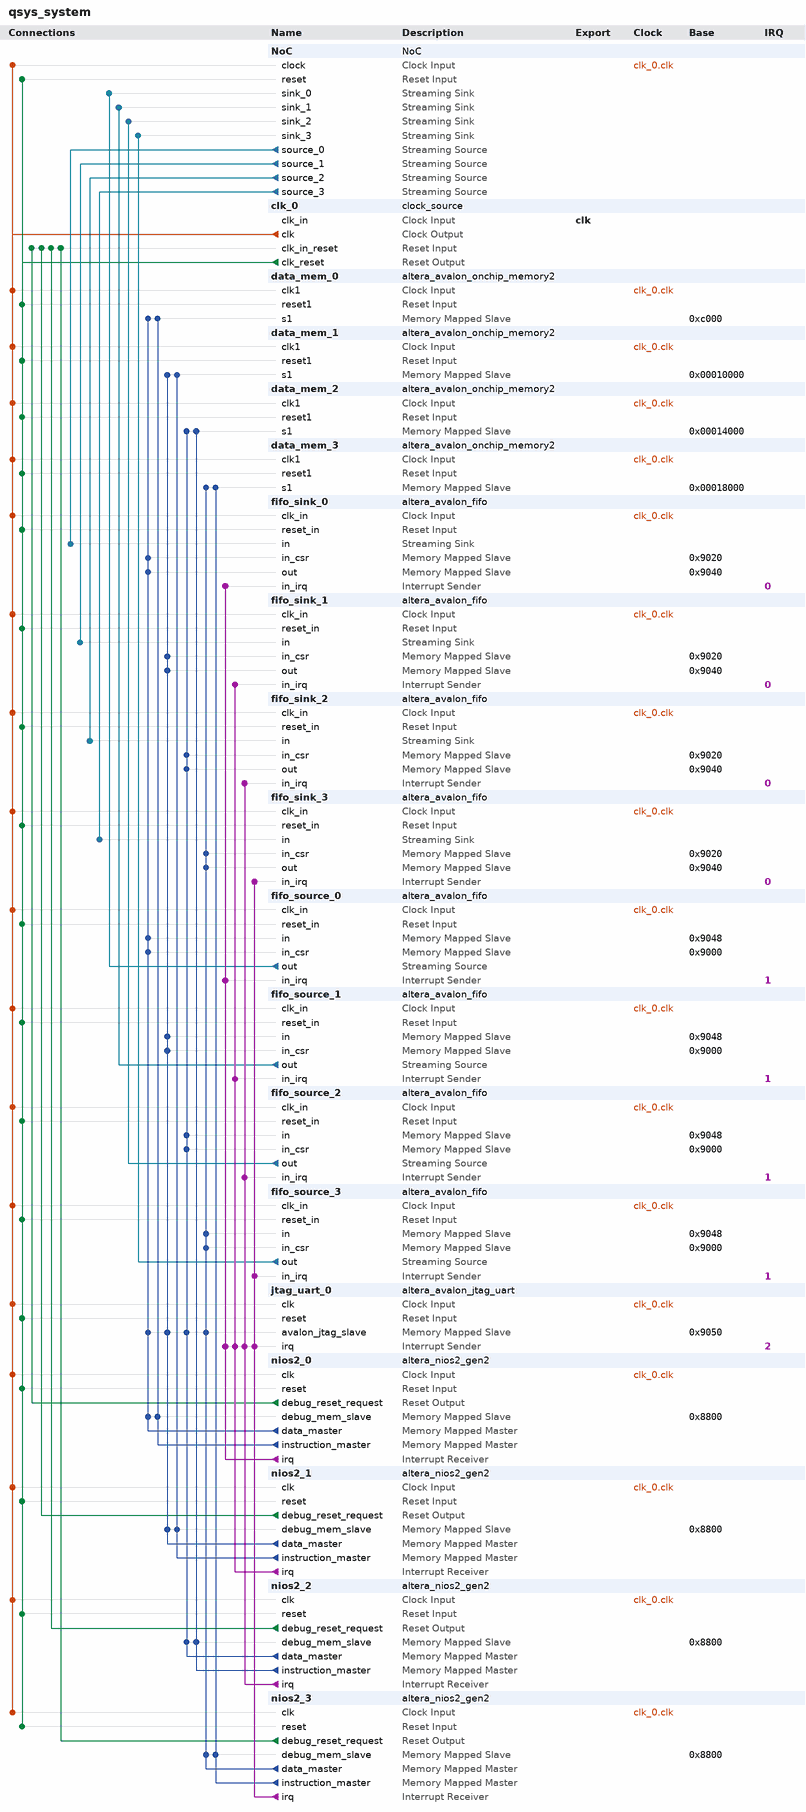
[diagram p0: system contents]
# Platform Designer (Qsys) system qsys_system, Cyclone V 5CSEMA4U23C6
# Parameters at their usual value, and those the tool derives, are not listed.
package require -exact qsys 17.1
create_system qsys_system
set_project_property DEVICE_FAMILY {Cyclone V}
set_project_property DEVICE 5CSEMA4U23C6

add_instance NoC NoC 1.0
set_instance_parameter_value NoC ColNo 2
set_instance_parameter_value NoC DataWidth 8
set_instance_parameter_value NoC PackWidth 8
set_instance_parameter_value NoC PhyCh 4
set_instance_parameter_value NoC PhyChAddr 2
set_instance_parameter_value NoC PhyRoCh 5
set_instance_parameter_value NoC PhyRoChAddr 3
set_instance_parameter_value NoC RoCh 1
set_instance_parameter_value NoC RoChAddr 1
set_instance_parameter_value NoC RowNo 2
set_instance_parameter_value NoC ViCh 1
set_instance_parameter_value NoC ViChAddr 1

add_instance clk_0 clock_source 17.1
set_instance_parameter_value clk_0 clockFrequency 50000000

add_instance data_mem_0 altera_avalon_onchip_memory2 17.1
set_instance_parameter_value data_mem_0 dataWidth 32
set_instance_parameter_value data_mem_0 dualPort false
set_instance_parameter_value data_mem_0 initMemContent true
set_instance_parameter_value data_mem_0 initializationFileName onchip_mem.hex
set_instance_parameter_value data_mem_0 memorySize 16384

add_instance data_mem_1 altera_avalon_onchip_memory2 17.1
set_instance_parameter_value data_mem_1 dataWidth 32
set_instance_parameter_value data_mem_1 dualPort false
set_instance_parameter_value data_mem_1 initMemContent true
set_instance_parameter_value data_mem_1 initializationFileName onchip_mem.hex
set_instance_parameter_value data_mem_1 memorySize 16384

add_instance data_mem_2 altera_avalon_onchip_memory2 17.1
set_instance_parameter_value data_mem_2 dataWidth 32
set_instance_parameter_value data_mem_2 dualPort false
set_instance_parameter_value data_mem_2 initMemContent true
set_instance_parameter_value data_mem_2 initializationFileName onchip_mem.hex
set_instance_parameter_value data_mem_2 memorySize 16384

add_instance data_mem_3 altera_avalon_onchip_memory2 17.1
set_instance_parameter_value data_mem_3 dataWidth 32
set_instance_parameter_value data_mem_3 dualPort false
set_instance_parameter_value data_mem_3 initMemContent true
set_instance_parameter_value data_mem_3 initializationFileName onchip_mem.hex
set_instance_parameter_value data_mem_3 memorySize 32000

add_instance fifo_sink_0 altera_avalon_fifo 17.1
set_instance_parameter_value fifo_sink_0 bitsPerSymbol 8
set_instance_parameter_value fifo_sink_0 channelWidth 8
set_instance_parameter_value fifo_sink_0 errorWidth 8
set_instance_parameter_value fifo_sink_0 fifoDepth 16
set_instance_parameter_value fifo_sink_0 fifoInputInterfaceOptions AVALONST_SINK
set_instance_parameter_value fifo_sink_0 fifoOutputInterfaceOptions AVALONMM_READ
set_instance_parameter_value fifo_sink_0 singleClockMode true
set_instance_parameter_value fifo_sink_0 symbolsPerBeat 4
set_instance_parameter_value fifo_sink_0 useIRQ true
set_instance_parameter_value fifo_sink_0 usePacket false
set_instance_parameter_value fifo_sink_0 useReadControl false

add_instance fifo_sink_1 altera_avalon_fifo 17.1
set_instance_parameter_value fifo_sink_1 bitsPerSymbol 8
set_instance_parameter_value fifo_sink_1 channelWidth 8
set_instance_parameter_value fifo_sink_1 errorWidth 8
set_instance_parameter_value fifo_sink_1 fifoDepth 16
set_instance_parameter_value fifo_sink_1 fifoInputInterfaceOptions AVALONST_SINK
set_instance_parameter_value fifo_sink_1 fifoOutputInterfaceOptions AVALONMM_READ
set_instance_parameter_value fifo_sink_1 singleClockMode true
set_instance_parameter_value fifo_sink_1 symbolsPerBeat 4
set_instance_parameter_value fifo_sink_1 useIRQ true
set_instance_parameter_value fifo_sink_1 usePacket false
set_instance_parameter_value fifo_sink_1 useReadControl false

add_instance fifo_sink_2 altera_avalon_fifo 17.1
set_instance_parameter_value fifo_sink_2 bitsPerSymbol 8
set_instance_parameter_value fifo_sink_2 channelWidth 8
set_instance_parameter_value fifo_sink_2 errorWidth 8
set_instance_parameter_value fifo_sink_2 fifoDepth 16
set_instance_parameter_value fifo_sink_2 fifoInputInterfaceOptions AVALONST_SINK
set_instance_parameter_value fifo_sink_2 fifoOutputInterfaceOptions AVALONMM_READ
set_instance_parameter_value fifo_sink_2 singleClockMode true
set_instance_parameter_value fifo_sink_2 symbolsPerBeat 4
set_instance_parameter_value fifo_sink_2 useIRQ true
set_instance_parameter_value fifo_sink_2 usePacket false
set_instance_parameter_value fifo_sink_2 useReadControl false

add_instance fifo_sink_3 altera_avalon_fifo 17.1
set_instance_parameter_value fifo_sink_3 bitsPerSymbol 8
set_instance_parameter_value fifo_sink_3 channelWidth 8
set_instance_parameter_value fifo_sink_3 errorWidth 8
set_instance_parameter_value fifo_sink_3 fifoDepth 16
set_instance_parameter_value fifo_sink_3 fifoInputInterfaceOptions AVALONST_SINK
set_instance_parameter_value fifo_sink_3 fifoOutputInterfaceOptions AVALONMM_READ
set_instance_parameter_value fifo_sink_3 singleClockMode true
set_instance_parameter_value fifo_sink_3 symbolsPerBeat 4
set_instance_parameter_value fifo_sink_3 useIRQ true
set_instance_parameter_value fifo_sink_3 usePacket false
set_instance_parameter_value fifo_sink_3 useReadControl false

add_instance fifo_source_0 altera_avalon_fifo 17.1
set_instance_parameter_value fifo_source_0 bitsPerSymbol 8
set_instance_parameter_value fifo_source_0 channelWidth 8
set_instance_parameter_value fifo_source_0 errorWidth 8
set_instance_parameter_value fifo_source_0 fifoDepth 16
set_instance_parameter_value fifo_source_0 fifoInputInterfaceOptions AVALONMM_WRITE
set_instance_parameter_value fifo_source_0 fifoOutputInterfaceOptions AVALONST_SOURCE
set_instance_parameter_value fifo_source_0 singleClockMode true
set_instance_parameter_value fifo_source_0 symbolsPerBeat 4
set_instance_parameter_value fifo_source_0 useIRQ true
set_instance_parameter_value fifo_source_0 usePacket false
set_instance_parameter_value fifo_source_0 useReadControl false

add_instance fifo_source_1 altera_avalon_fifo 17.1
set_instance_parameter_value fifo_source_1 bitsPerSymbol 8
set_instance_parameter_value fifo_source_1 channelWidth 8
set_instance_parameter_value fifo_source_1 errorWidth 8
set_instance_parameter_value fifo_source_1 fifoDepth 16
set_instance_parameter_value fifo_source_1 fifoInputInterfaceOptions AVALONMM_WRITE
set_instance_parameter_value fifo_source_1 fifoOutputInterfaceOptions AVALONST_SOURCE
set_instance_parameter_value fifo_source_1 singleClockMode true
set_instance_parameter_value fifo_source_1 symbolsPerBeat 4
set_instance_parameter_value fifo_source_1 useIRQ true
set_instance_parameter_value fifo_source_1 usePacket false
set_instance_parameter_value fifo_source_1 useReadControl false

add_instance fifo_source_2 altera_avalon_fifo 17.1
set_instance_parameter_value fifo_source_2 bitsPerSymbol 8
set_instance_parameter_value fifo_source_2 channelWidth 8
set_instance_parameter_value fifo_source_2 errorWidth 8
set_instance_parameter_value fifo_source_2 fifoDepth 16
set_instance_parameter_value fifo_source_2 fifoInputInterfaceOptions AVALONMM_WRITE
set_instance_parameter_value fifo_source_2 fifoOutputInterfaceOptions AVALONST_SOURCE
set_instance_parameter_value fifo_source_2 singleClockMode true
set_instance_parameter_value fifo_source_2 symbolsPerBeat 4
set_instance_parameter_value fifo_source_2 useIRQ true
set_instance_parameter_value fifo_source_2 usePacket false
set_instance_parameter_value fifo_source_2 useReadControl false

add_instance fifo_source_3 altera_avalon_fifo 17.1
set_instance_parameter_value fifo_source_3 bitsPerSymbol 8
set_instance_parameter_value fifo_source_3 channelWidth 8
set_instance_parameter_value fifo_source_3 errorWidth 8
set_instance_parameter_value fifo_source_3 fifoDepth 16
set_instance_parameter_value fifo_source_3 fifoInputInterfaceOptions AVALONMM_WRITE
set_instance_parameter_value fifo_source_3 fifoOutputInterfaceOptions AVALONST_SOURCE
set_instance_parameter_value fifo_source_3 singleClockMode true
set_instance_parameter_value fifo_source_3 symbolsPerBeat 4
set_instance_parameter_value fifo_source_3 useIRQ true
set_instance_parameter_value fifo_source_3 usePacket false
set_instance_parameter_value fifo_source_3 useReadControl false

add_instance jtag_uart_0 altera_avalon_jtag_uart 17.1
set_instance_parameter_value jtag_uart_0 simInteractiveOptions NO_INTERACTIVE_WINDOWS

add_instance nios2_0 altera_nios2_gen2 17.1
set_instance_parameter_value nios2_0 dcache_size 2048
set_instance_parameter_value nios2_0 exceptionSlave data_mem_0.s1
set_instance_parameter_value nios2_0 icache_size 4096
set_instance_parameter_value nios2_0 impl Tiny
set_instance_parameter_value nios2_0 resetSlave data_mem_0.s1

add_instance nios2_1 altera_nios2_gen2 17.1
set_instance_parameter_value nios2_1 dcache_size 2048
set_instance_parameter_value nios2_1 exceptionSlave data_mem_1.s1
set_instance_parameter_value nios2_1 icache_size 4096
set_instance_parameter_value nios2_1 impl Tiny
set_instance_parameter_value nios2_1 resetSlave data_mem_1.s1

add_instance nios2_2 altera_nios2_gen2 17.1
set_instance_parameter_value nios2_2 dcache_size 2048
set_instance_parameter_value nios2_2 exceptionSlave data_mem_2.s1
set_instance_parameter_value nios2_2 icache_size 4096
set_instance_parameter_value nios2_2 impl Tiny
set_instance_parameter_value nios2_2 resetSlave data_mem_2.s1

add_instance nios2_3 altera_nios2_gen2 17.1
set_instance_parameter_value nios2_3 dcache_size 2048
set_instance_parameter_value nios2_3 exceptionSlave data_mem_3.s1
set_instance_parameter_value nios2_3 icache_size 4096
set_instance_parameter_value nios2_3 impl Tiny
set_instance_parameter_value nios2_3 resetSlave data_mem_3.s1

# connections
add_connection clk_0.clk data_mem_0.clk1 clock
add_connection clk_0.clk data_mem_1.clk1 clock
add_connection clk_0.clk data_mem_2.clk1 clock
add_connection clk_0.clk data_mem_3.clk1 clock
add_connection clk_0.clk fifo_sink_0.clk_in clock
add_connection clk_0.clk fifo_sink_1.clk_in clock
add_connection clk_0.clk fifo_sink_2.clk_in clock
add_connection clk_0.clk fifo_sink_3.clk_in clock
add_connection clk_0.clk fifo_source_0.clk_in clock
add_connection clk_0.clk fifo_source_1.clk_in clock
add_connection clk_0.clk fifo_source_2.clk_in clock
add_connection clk_0.clk fifo_source_3.clk_in clock
add_connection clk_0.clk jtag_uart_0.clk clock
add_connection clk_0.clk nios2_0.clk clock
add_connection clk_0.clk nios2_1.clk clock
add_connection clk_0.clk nios2_2.clk clock
add_connection clk_0.clk nios2_3.clk clock
add_connection clk_0.clk NoC.clock clock
add_connection clk_0.clk_reset data_mem_0.reset1 reset
add_connection clk_0.clk_reset data_mem_1.reset1 reset
add_connection clk_0.clk_reset data_mem_2.reset1 reset
add_connection clk_0.clk_reset data_mem_3.reset1 reset
add_connection clk_0.clk_reset fifo_sink_0.reset_in reset
add_connection clk_0.clk_reset fifo_sink_1.reset_in reset
add_connection clk_0.clk_reset fifo_sink_2.reset_in reset
add_connection clk_0.clk_reset fifo_sink_3.reset_in reset
add_connection clk_0.clk_reset fifo_source_0.reset_in reset
add_connection clk_0.clk_reset fifo_source_1.reset_in reset
add_connection clk_0.clk_reset fifo_source_2.reset_in reset
add_connection clk_0.clk_reset fifo_source_3.reset_in reset
add_connection clk_0.clk_reset jtag_uart_0.reset reset
add_connection clk_0.clk_reset nios2_0.reset reset
add_connection clk_0.clk_reset nios2_1.reset reset
add_connection clk_0.clk_reset nios2_2.reset reset
add_connection clk_0.clk_reset nios2_3.reset reset
add_connection clk_0.clk_reset NoC.reset reset
add_connection nios2_0.debug_reset_request clk_0.clk_in_reset reset
add_connection nios2_1.debug_reset_request clk_0.clk_in_reset reset
add_connection nios2_2.debug_reset_request clk_0.clk_in_reset reset
add_connection nios2_3.debug_reset_request clk_0.clk_in_reset reset
add_connection nios2_0.data_master data_mem_0.s1 avalon
set_connection_parameter_value nios2_0.data_master/data_mem_0.s1 baseAddress 0xc000
add_connection nios2_0.data_master fifo_sink_0.in_csr avalon
set_connection_parameter_value nios2_0.data_master/fifo_sink_0.in_csr baseAddress 0x9020
add_connection nios2_0.data_master fifo_sink_0.out avalon
set_connection_parameter_value nios2_0.data_master/fifo_sink_0.out baseAddress 0x9040
add_connection nios2_0.data_master fifo_source_0.in avalon
set_connection_parameter_value nios2_0.data_master/fifo_source_0.in baseAddress 0x9048
add_connection nios2_0.data_master fifo_source_0.in_csr avalon
set_connection_parameter_value nios2_0.data_master/fifo_source_0.in_csr baseAddress 0x9000
add_connection nios2_0.data_master jtag_uart_0.avalon_jtag_slave avalon
set_connection_parameter_value nios2_0.data_master/jtag_uart_0.avalon_jtag_slave baseAddress 0x9050
add_connection nios2_0.data_master nios2_0.debug_mem_slave avalon
set_connection_parameter_value nios2_0.data_master/nios2_0.debug_mem_slave baseAddress 0x8800
add_connection nios2_0.instruction_master data_mem_0.s1 avalon
set_connection_parameter_value nios2_0.instruction_master/data_mem_0.s1 baseAddress 0xc000
add_connection nios2_0.instruction_master nios2_0.debug_mem_slave avalon
set_connection_parameter_value nios2_0.instruction_master/nios2_0.debug_mem_slave baseAddress 0x8800
add_connection nios2_1.data_master data_mem_1.s1 avalon
set_connection_parameter_value nios2_1.data_master/data_mem_1.s1 baseAddress 0x00010000
add_connection nios2_1.data_master fifo_sink_1.in_csr avalon
set_connection_parameter_value nios2_1.data_master/fifo_sink_1.in_csr baseAddress 0x9020
add_connection nios2_1.data_master fifo_sink_1.out avalon
set_connection_parameter_value nios2_1.data_master/fifo_sink_1.out baseAddress 0x9040
add_connection nios2_1.data_master fifo_source_1.in avalon
set_connection_parameter_value nios2_1.data_master/fifo_source_1.in baseAddress 0x9048
add_connection nios2_1.data_master fifo_source_1.in_csr avalon
set_connection_parameter_value nios2_1.data_master/fifo_source_1.in_csr baseAddress 0x9000
add_connection nios2_1.data_master jtag_uart_0.avalon_jtag_slave avalon
set_connection_parameter_value nios2_1.data_master/jtag_uart_0.avalon_jtag_slave baseAddress 0x9050
add_connection nios2_1.data_master nios2_1.debug_mem_slave avalon
set_connection_parameter_value nios2_1.data_master/nios2_1.debug_mem_slave baseAddress 0x8800
add_connection nios2_1.instruction_master data_mem_1.s1 avalon
set_connection_parameter_value nios2_1.instruction_master/data_mem_1.s1 baseAddress 0x00010000
add_connection nios2_1.instruction_master nios2_1.debug_mem_slave avalon
set_connection_parameter_value nios2_1.instruction_master/nios2_1.debug_mem_slave baseAddress 0x8800
add_connection nios2_2.data_master data_mem_2.s1 avalon
set_connection_parameter_value nios2_2.data_master/data_mem_2.s1 baseAddress 0x00014000
add_connection nios2_2.data_master fifo_sink_2.in_csr avalon
set_connection_parameter_value nios2_2.data_master/fifo_sink_2.in_csr baseAddress 0x9020
add_connection nios2_2.data_master fifo_sink_2.out avalon
set_connection_parameter_value nios2_2.data_master/fifo_sink_2.out baseAddress 0x9040
add_connection nios2_2.data_master fifo_source_2.in avalon
set_connection_parameter_value nios2_2.data_master/fifo_source_2.in baseAddress 0x9048
add_connection nios2_2.data_master fifo_source_2.in_csr avalon
set_connection_parameter_value nios2_2.data_master/fifo_source_2.in_csr baseAddress 0x9000
add_connection nios2_2.data_master jtag_uart_0.avalon_jtag_slave avalon
set_connection_parameter_value nios2_2.data_master/jtag_uart_0.avalon_jtag_slave baseAddress 0x9050
add_connection nios2_2.data_master nios2_2.debug_mem_slave avalon
set_connection_parameter_value nios2_2.data_master/nios2_2.debug_mem_slave baseAddress 0x8800
add_connection nios2_2.instruction_master data_mem_2.s1 avalon
set_connection_parameter_value nios2_2.instruction_master/data_mem_2.s1 baseAddress 0x00014000
add_connection nios2_2.instruction_master nios2_2.debug_mem_slave avalon
set_connection_parameter_value nios2_2.instruction_master/nios2_2.debug_mem_slave baseAddress 0x8800
add_connection nios2_3.data_master data_mem_3.s1 avalon
set_connection_parameter_value nios2_3.data_master/data_mem_3.s1 baseAddress 0x00018000
add_connection nios2_3.data_master fifo_sink_3.in_csr avalon
set_connection_parameter_value nios2_3.data_master/fifo_sink_3.in_csr baseAddress 0x9020
add_connection nios2_3.data_master fifo_sink_3.out avalon
set_connection_parameter_value nios2_3.data_master/fifo_sink_3.out baseAddress 0x9040
add_connection nios2_3.data_master fifo_source_3.in avalon
set_connection_parameter_value nios2_3.data_master/fifo_source_3.in baseAddress 0x9048
add_connection nios2_3.data_master fifo_source_3.in_csr avalon
set_connection_parameter_value nios2_3.data_master/fifo_source_3.in_csr baseAddress 0x9000
add_connection nios2_3.data_master jtag_uart_0.avalon_jtag_slave avalon
set_connection_parameter_value nios2_3.data_master/jtag_uart_0.avalon_jtag_slave baseAddress 0x9050
add_connection nios2_3.data_master nios2_3.debug_mem_slave avalon
set_connection_parameter_value nios2_3.data_master/nios2_3.debug_mem_slave baseAddress 0x8800
add_connection nios2_3.instruction_master data_mem_3.s1 avalon
set_connection_parameter_value nios2_3.instruction_master/data_mem_3.s1 baseAddress 0x00018000
add_connection nios2_3.instruction_master nios2_3.debug_mem_slave avalon
set_connection_parameter_value nios2_3.instruction_master/nios2_3.debug_mem_slave baseAddress 0x8800
add_connection fifo_source_0.out NoC.sink_0 avalon_streaming
add_connection fifo_source_1.out NoC.sink_1 avalon_streaming
add_connection fifo_source_2.out NoC.sink_2 avalon_streaming
add_connection fifo_source_3.out NoC.sink_3 avalon_streaming
add_connection NoC.source_0 fifo_sink_0.in avalon_streaming
add_connection NoC.source_1 fifo_sink_1.in avalon_streaming
add_connection NoC.source_2 fifo_sink_2.in avalon_streaming
add_connection NoC.source_3 fifo_sink_3.in avalon_streaming
add_connection nios2_0.irq fifo_sink_0.in_irq interrupt
set_connection_parameter_value nios2_0.irq/fifo_sink_0.in_irq irqNumber 0
add_connection nios2_0.irq fifo_source_0.in_irq interrupt
set_connection_parameter_value nios2_0.irq/fifo_source_0.in_irq irqNumber 1
add_connection nios2_0.irq jtag_uart_0.irq interrupt
set_connection_parameter_value nios2_0.irq/jtag_uart_0.irq irqNumber 2
add_connection nios2_1.irq fifo_sink_1.in_irq interrupt
set_connection_parameter_value nios2_1.irq/fifo_sink_1.in_irq irqNumber 0
add_connection nios2_1.irq fifo_source_1.in_irq interrupt
set_connection_parameter_value nios2_1.irq/fifo_source_1.in_irq irqNumber 1
add_connection nios2_1.irq jtag_uart_0.irq interrupt
set_connection_parameter_value nios2_1.irq/jtag_uart_0.irq irqNumber 2
add_connection nios2_2.irq fifo_sink_2.in_irq interrupt
set_connection_parameter_value nios2_2.irq/fifo_sink_2.in_irq irqNumber 0
add_connection nios2_2.irq fifo_source_2.in_irq interrupt
set_connection_parameter_value nios2_2.irq/fifo_source_2.in_irq irqNumber 1
add_connection nios2_2.irq jtag_uart_0.irq interrupt
set_connection_parameter_value nios2_2.irq/jtag_uart_0.irq irqNumber 2
add_connection nios2_3.irq fifo_sink_3.in_irq interrupt
set_connection_parameter_value nios2_3.irq/fifo_sink_3.in_irq irqNumber 0
add_connection nios2_3.irq fifo_source_3.in_irq interrupt
set_connection_parameter_value nios2_3.irq/fifo_source_3.in_irq irqNumber 1
add_connection nios2_3.irq jtag_uart_0.irq interrupt
set_connection_parameter_value nios2_3.irq/jtag_uart_0.irq irqNumber 2

# exported interfaces
add_interface clk clock sink
set_interface_property clk EXPORT_OF clk_0.clk_in

set_interconnect_requirement {$system} qsys_mm.clockCrossingAdapter HANDSHAKE
set_interconnect_requirement {$system} qsys_mm.enableEccProtection FALSE
set_interconnect_requirement {$system} qsys_mm.insertDefaultSlave FALSE
set_interconnect_requirement {$system} qsys_mm.maxAdditionalLatency 1

save_system qsys_system.qsys
